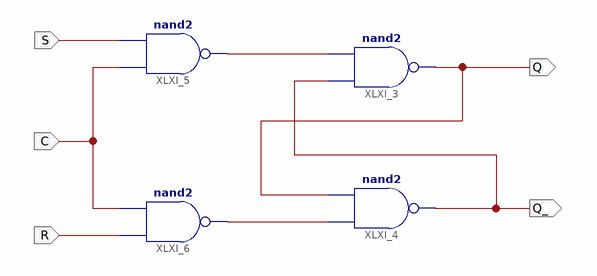
[diagram p0: schematic sheet 1]
// Xilinx ISE schematic CSR_Latch.sch (kintex7) as structural Verilog: 4 symbols, 5 ports
module CSR_Latch (
  input  C,
  input  S,
  input  R,
  output Q_,
  output Q
);

  wire XLXN_9, XLXN_10;

  nand XLXI_3 (Q, Q_, XLXN_9);
  nand XLXI_4 (Q_, XLXN_10, Q);
  nand XLXI_5 (XLXN_9, C, S);
  nand XLXI_6 (XLXN_10, R, C);
endmodule
